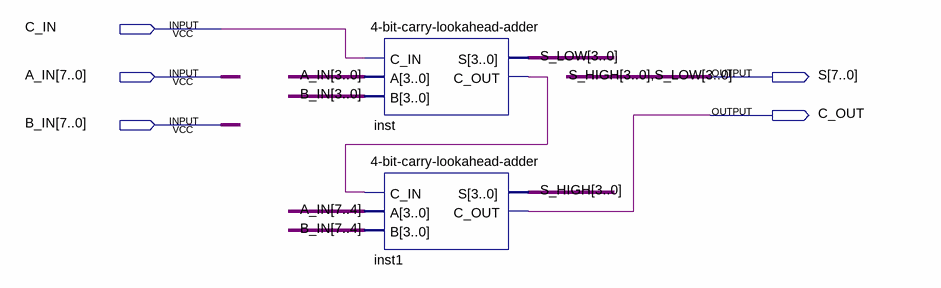
[diagram p0: schematic sheet]
// Quartus schematic 8-bit-add.bdf as structural Verilog: 2 symbols, 5 pins
module \8-bit-add  (
  input  C_IN,
  input  [7:0] A_IN,
  input  [7:0] B_IN,
  output [7:0] S,
  output C_OUT
);

  wire inst_c_out;

  \4-bit-carry-lookahead-adder  inst (.C_IN(C_IN), .A(A_IN[3:0]), .B(B_IN[3:0]), .S(S[3:0]), .C_OUT(inst_c_out));
  \4-bit-carry-lookahead-adder  inst1 (.C_IN(inst_c_out), .A(A_IN[7:4]), .B(B_IN[7:4]), .S(S[7:4]), .C_OUT(C_OUT));

  // Other names for the same wires on the sheet: S_HIGH[3:0] = S[7:4]; S_LOW[3:0] = S[3:0]
endmodule
